# EAGLE schematic schematic (EAGLE 6.5.0)
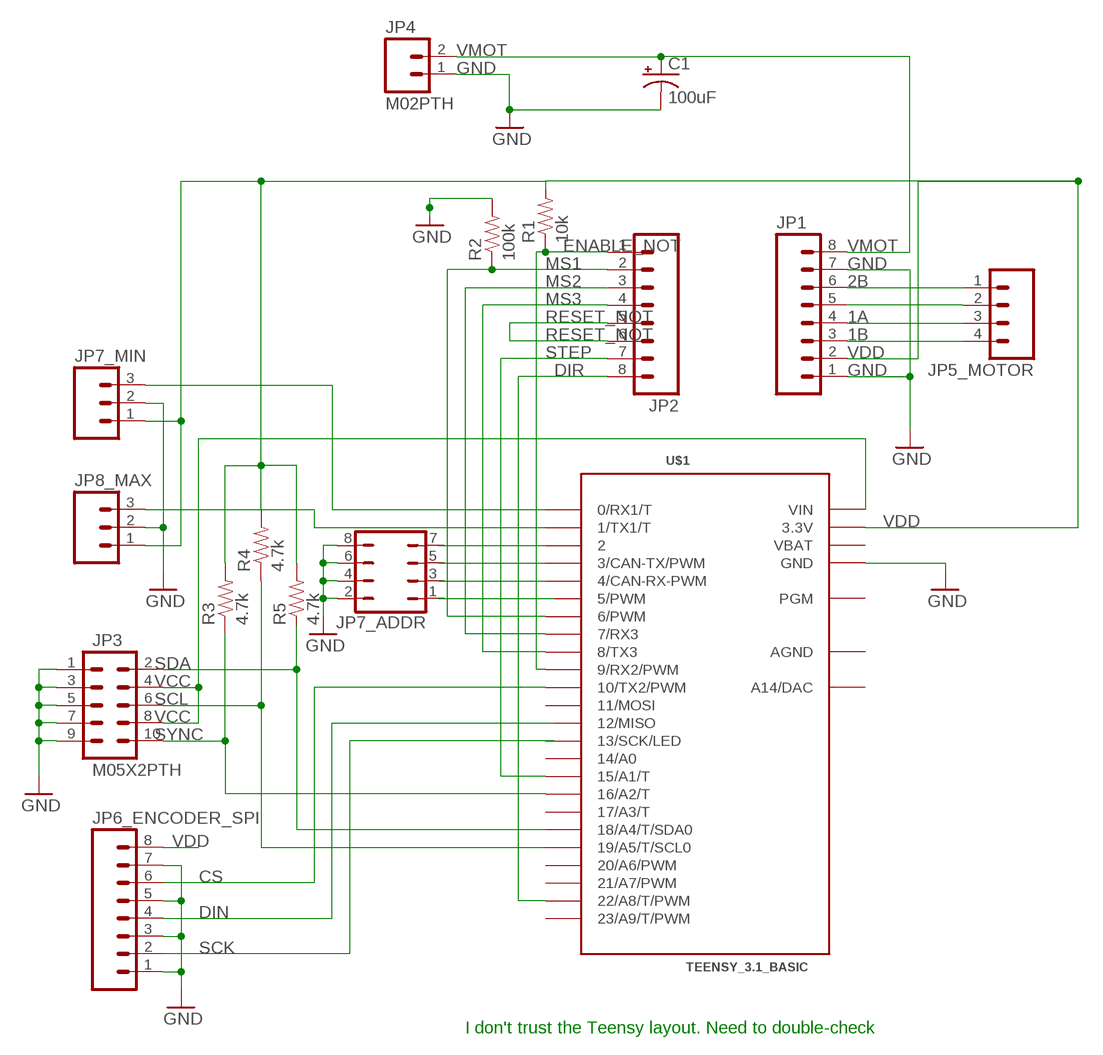
[diagram p0: schematic, sheet 1]

## Parts
C1  100uF  100UF-63V-20%(ELECT)  [PANASONIC_H13]
JP1  M08  [1X08_PIN1_NO_SILK]
JP2  M08  [1X08_PIN1_NO_SILK]
JP3  M05X2PTH  [AVR_ICSP]
JP4  M02PTH  [1X02]
JP5_MOTOR  M04PTH  [1X04]
JP6_ENCODER_SPI  M08  [1X08_PIN1_NO_SILK]
JP7_ADDR  JP4Q  [JP4Q]
JP7_MIN  M03PTH  [1X03]
JP8_MAX  M03PTH  [1X03]
R1  10k  RESISTORPTH-1/4W  [AXIAL-0.4]
R2  100k  RESISTORPTH-1/4W  [AXIAL-0.4]
R3  4.7k  RESISTORPTH-1/4W  [AXIAL-0.4]
R4  4.7k  RESISTORPTH-1/4W  [AXIAL-0.4]
R5  4.7k  RESISTORPTH-1/4W  [AXIAL-0.4]
U$1  TEENSY_3.1_BASIC  [TEENSY_3.1_BASIC]

## Nets
1A: JP1.4 JP5_MOTOR.3
1B: JP1.3 JP5_MOTOR.4
2B: JP1.6 JP5_MOTOR.1
CS: JP6_ENCODER_SPI.6 U$1.10(10/TX2/PWM)
DIN: JP6_ENCODER_SPI.4
DIR: JP2.8 U$1.22/A8(22/A8/T/PWM)
ENABLE_NOT: JP2.1 R1.P$1 U$1.9(9/RX2/PWM)
GND: C1.- JP1.1 JP1.7 JP3.1 JP3.3 JP3.5 JP3.7 JP3.9 JP4.1 JP6_ENCODER_SPI.1 JP6_ENCODER_SPI.3 JP6_ENCODER_SPI.5 JP6_ENCODER_SPI.7 JP7_ADDR.2 JP7_ADDR.4 JP7_ADDR.6 JP7_ADDR.8 JP7_MIN.2 JP8_MAX.2 R2.P$2 U$1.GND U$1.GND1(GND)
MS1: JP2.2 R2.P$1 U$1.6(6/PWM)
MS2: JP2.3 U$1.7(7/RX3)
MS3: JP2.4 U$1.8(8/TX3)
N$1: JP7_MIN.1 JP8_MAX.1 R1.P$2 R3.P$2 R4.P$2 R5.P$2
N$2: JP7_MIN.3 U$1.0(0/RX1/T)
N$3: JP8_MAX.3 U$1.1(1/TX1/T)
N$4: U$1.2
N$5: U$1.3(3/CAN-TX/PWM)
N$6: U$1.4(4/CAN-RX-PWM)
N$8: JP1.5 JP5_MOTOR.2
RESET_NOT: JP2.5 JP2.6
SCK: JP6_ENCODER_SPI.2
SCL: JP3.6 R4.P$1 U$1.19/A5(19/A5/T/SCL0)
SDA: JP3.2 U$1.18/A4(18/A4/T/SDA0)
STEP: JP2.7 U$1.15/A1(15/A1/T)
SYNC: JP3.10 R3.P$1 U$1.16/A2(16/A2/T)
VCC: JP3.4 JP3.8 U$1.VIN
VDD: JP1.2 JP6_ENCODER_SPI.8 U$1.3.3V U$1.3.3V1(3.3V)
VMOT: C1.+ JP1.8 JP4.2
Unconnected: JP7_ADDR.1 JP7_ADDR.3 JP7_ADDR.5 JP7_ADDR.7 R5.P$1 U$1.5(5/PWM) U$1.11(11/MOSI) U$1.12(12/MISO) U$1.13(13/SCK/LED) U$1.14/A0 U$1.17/A3(17/A3/T) U$1.20/A6(20/A6/PWM) U$1.21/A7(21/A7/PWM) U$1.23/A9(23/A9/T/PWM) U$1.A14(A14/DAC) U$1.PGM

## Notes on the sheet
- I don't trust the Teensy layout. Need to double-check

## Power pins joined to a net without a drawn wire
AGND: U$1.AGND
VBAT: U$1.VBAT

## Library data of the parts
C1 = SparkFun-Capacitors:100UF-63V-20%(ELECT): CAP-08362 100uF electrolytic SMT 63V 20%; PROD_ID: CAP-08362
JP1 JP2 JP6_ENCODER_SPI = SparkFun-Connectors:M08: Header 8 Standard 8-pin 0.1" header. Use with straight break away headers (SKU : PRT-00116), right angle break away headers (PRT-00553), swiss pins (PRT-00743), machine pins (PRT-00117), and female headers (PRT-00115).
JP3 = SparkFun-Connectors:M05X2: Header 5x2 Standard 10-pin dual row 0.1" header. Commonly used with AVR-ISP. Use with Spark Fun Electronics SKU: PRT-00778
JP4 = SparkFun-Connectors:M02: Standard 2-pin 0.1" header. Use with - straight break away headers ( PRT-00116) - right angle break away headers (PRT-00553) - swiss pins (PRT-00743) - machine pins (PRT-00117) - female headers (PRT-00115) Molex polarized connector foot print use with: PRT-08233 with associated crimp pins and housings. 2.54_SCREWTERM for use with PRT-10571. 3.5mm Screw Terminal footprints for PRT-08084 5mm Screw Terminal footprints for use with PRT-08433
JP5_MOTOR = SparkFun-Connectors:M04: Header 4 Standard 4-pin 0.1" header. Use with straight break away headers (SKU : PRT-00116), right angle break away headers (PRT-00553), swiss pins (PRT-00743), machine pins (PRT-00117), and female headers (PRT-00115). Molex polarized connector foot print use with SKU : PRT-08231 with associated crimp pins and housings. 1MM SMD Version SKU: PRT-10208
JP7_ADDR = jumper:JP4Q: JUMPER
JP7_MIN JP8_MAX = SparkFun-Connectors:M03: Header 3 Standard 3-pin 0.1" header. Use with straight break away headers (SKU : PRT-00116), right angle break away headers (PRT-00553), swiss pins (PRT-00743), machine pins (PRT-00117), and female headers (PRT-00115). Molex polarized connector foot print use with SKU : PRT-08232 with associated crimp pins and housings.
R1-R5 = SparkFun-Resistors:RESISTOR: Resistor Basic schematic elements and footprints for 0603, 1206, and PTH resistors.
U$1 = Teensy_3_Series_Board_v1.0:TEENSY_3.1_BASIC: Footprint for Teensy 3.1 board using all pin connections on the outer perimeter